# EAGLE design ArduinoShield_SFE_2x16LCD_RGB (EAGLE 6.2)
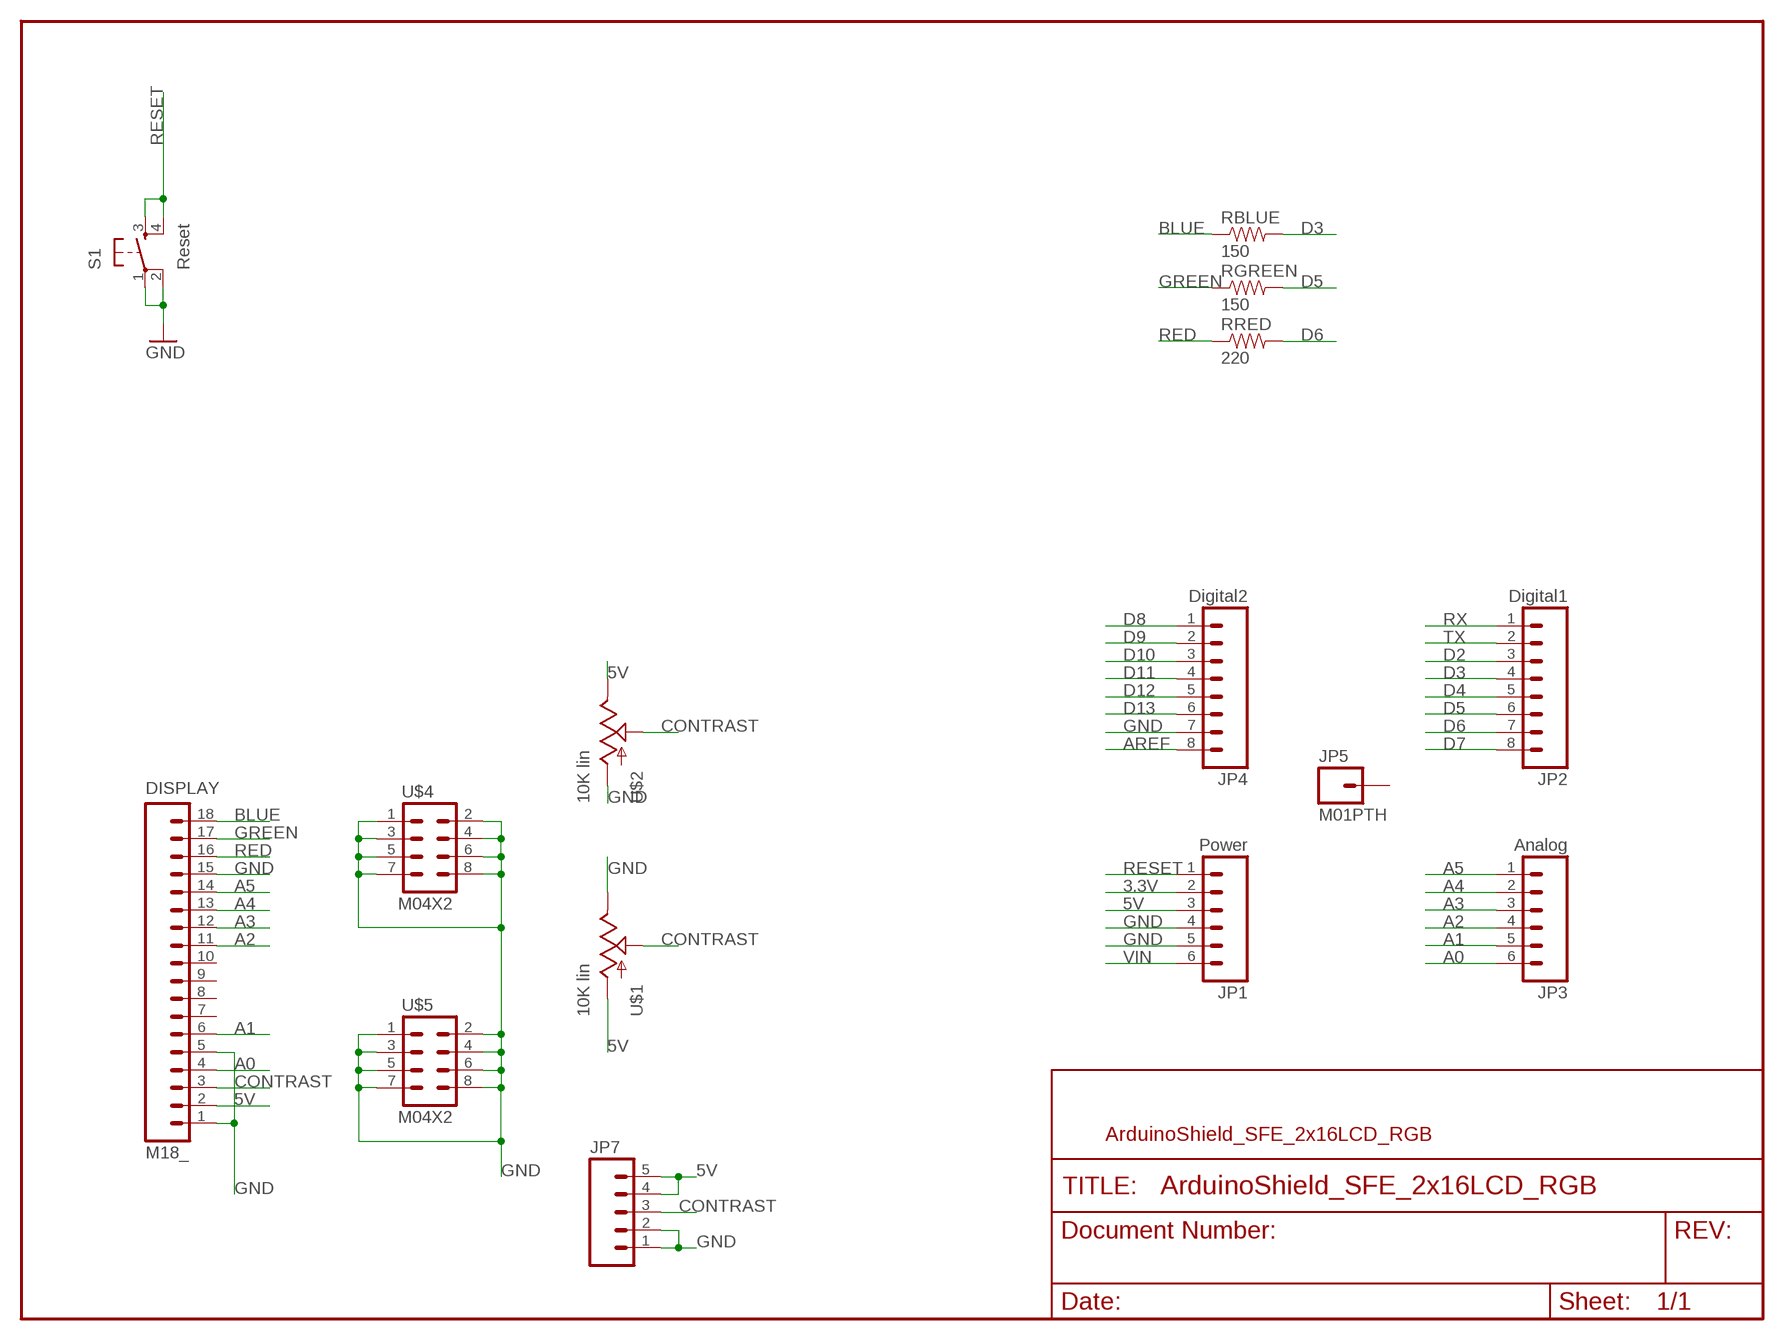
[diagram p0: schematic, sheet 1]

## Parts
DISPLAY  M18_  [1X18]
JP1  Power  M06SIP  [1X06]
JP2  Digital1  M08  [1X08]
JP3  Analog  M06SIP  [1X06]
JP4  Digital2  M08  [1X08]
JP5  M01PTH  [1X01]
JP7  M05PTH_LONGPADS  [1X05_LONGPADS]
RBLUE  150  RESISTORPTH-1/2W  [AXIAL-0.5]
RGREEN  150  RESISTORPTH-1/2W  [AXIAL-0.5]
RRED  220  RESISTORPTH-1/2W  [AXIAL-0.5]
S1  Reset  TAC_SWITCHPTH  [TACTILE-PTH]
U$1  10K lin  POT  [ALPS_POT]
U$2  10K lin  POT-RV16AF-20  [POT_ALPHA_RV16AF-20]
U$4  M04X2  [2X4]
U$5  M04X2  [2X4]

## Nets
3.3V: JP1.2
5V [power]: DISPLAY.2 JP1.3 JP7.4 JP7.5 U$1.P$3(A) U$2.3(E)
A0: DISPLAY.4 JP3.6
A1: DISPLAY.6 JP3.5
A2: DISPLAY.11 JP3.4
A3: DISPLAY.12 JP3.3
A4: DISPLAY.13 JP3.2
A5: DISPLAY.14 JP3.1
AREF: JP4.8
BLUE: DISPLAY.18 RBLUE.P$1
CONTRAST: DISPLAY.3 JP7.3 U$1.P$2(S) U$2.2(S)
D2: JP2.3
D3: JP2.4 RBLUE.P$2
D4: JP2.5
D5: JP2.6 RGREEN.P$2
D6: JP2.7 RRED.P$2
D7: JP2.8
D8: JP4.1
D9: JP4.2
D10: JP4.3
D11: JP4.4
D12: JP4.5
D13: JP4.6
GND [power]: DISPLAY.1 DISPLAY.5 DISPLAY.15 JP1.4 JP1.5 JP4.7 JP7.1 JP7.2 S1.1 S1.2 U$1.P$1(E) U$2.1(A) U$4.1 U$4.2 U$4.3 U$4.4 U$4.5 U$4.6 U$4.7 U$4.8 U$5.1 U$5.2 U$5.3 U$5.4 U$5.5 U$5.6 U$5.7 U$5.8
GREEN: DISPLAY.17 RGREEN.P$1
RED: DISPLAY.16 RRED.P$1
RESET: JP1.1 S1.3 S1.4
RX: JP2.1
TX: JP2.2
VIN [power]: JP1.6
Unconnected: DISPLAY.7 DISPLAY.8 DISPLAY.9 DISPLAY.10 JP5.1

## Notes on the sheet
- ArduinoShield_SFE_2x16LCD_RGB

## Library data of the parts
DISPLAY = SparkFun:M18
JP1 JP3 = SparkFun:M06: Header 6 Standard 6-pin 0.1" header. Use with straight break away headers (SKU : PRT-00116), right angle break away headers (PRT-00553), swiss pins (PRT-00743), machine pins (PRT-00117), and female headers (PRT-00115). Molex polarized connector foot print use with SKU : PRT-08094 with associated crimp pins and housings. NOTES ON THE VARIANTS LOCK and LOCK_LONGPADS... This footprint was designed to help hold the alignment of a through-hole component (i.e. 6-pin header) while soldering it into place. You may notice that each hole has been shifted either up or down by 0.005 of an inch from it's more standard position (which is a perfectly straight line). This slight alteration caused the pins (the squares in the middle) to touch the edges of the holes. Because they are alternating, it causes a "brace" to hold the component in place. 0.005 has proven to be the perfect amount of "off-center" position when using our standard breakaway headers. Although looks a little odd when you look at the bare footprint, once you have a header in there, the alteration is very hard to notice. Also, if you push a header all the way into place, it is covered up entirely on the bottom side. This idea of altering the position of holes to aid alignment will be further integrated into the Sparkfun Library for other footprints. It can help hold any component with 3 or more connection pins.
JP2 JP4 = SparkFun:M08: Header 8 Standard 8-pin 0.1" header. Use with straight break away headers (SKU : PRT-00116), right angle break away headers (PRT-00553), swiss pins (PRT-00743), machine pins (PRT-00117), and female headers (PRT-00115).
JP5 = SparkFun:M01: Header 1 Standard 1-pin 0.1" header. Use with straight break away headers (SKU : PRT-00116), right angle break away headers (PRT-00553), swiss pins (PRT-00743), machine pins (PRT-00117), and female headers (PRT-00115).
JP7 = SparkFun:M05: Header 5 Standard 5-pin 0.1" header. Use with straight break away headers (SKU : PRT-00116), right angle break away headers (PRT-00553), swiss pins (PRT-00743), machine pins (PRT-00117), and female headers (PRT-00115). Molex polarized connector foot print use with SKU : PRT-08230 with associated crimp pins and housings.
RBLUE RGREEN RRED = SparkFun:RESISTOR: Resistor Basic schematic elements and footprints for 0603, 1206, and PTH resistors.
S1 = SparkFun:TAC_SWITCH: Momentary Switch Button commonly used for reset or general input. Spark Fun Electronics SKU : COM-00097
U$1 U$2 = SparkFun:POT
U$4 U$5 = SparkFun:M04X2

## Net classes
1 power: width 0.254 mm

## Board
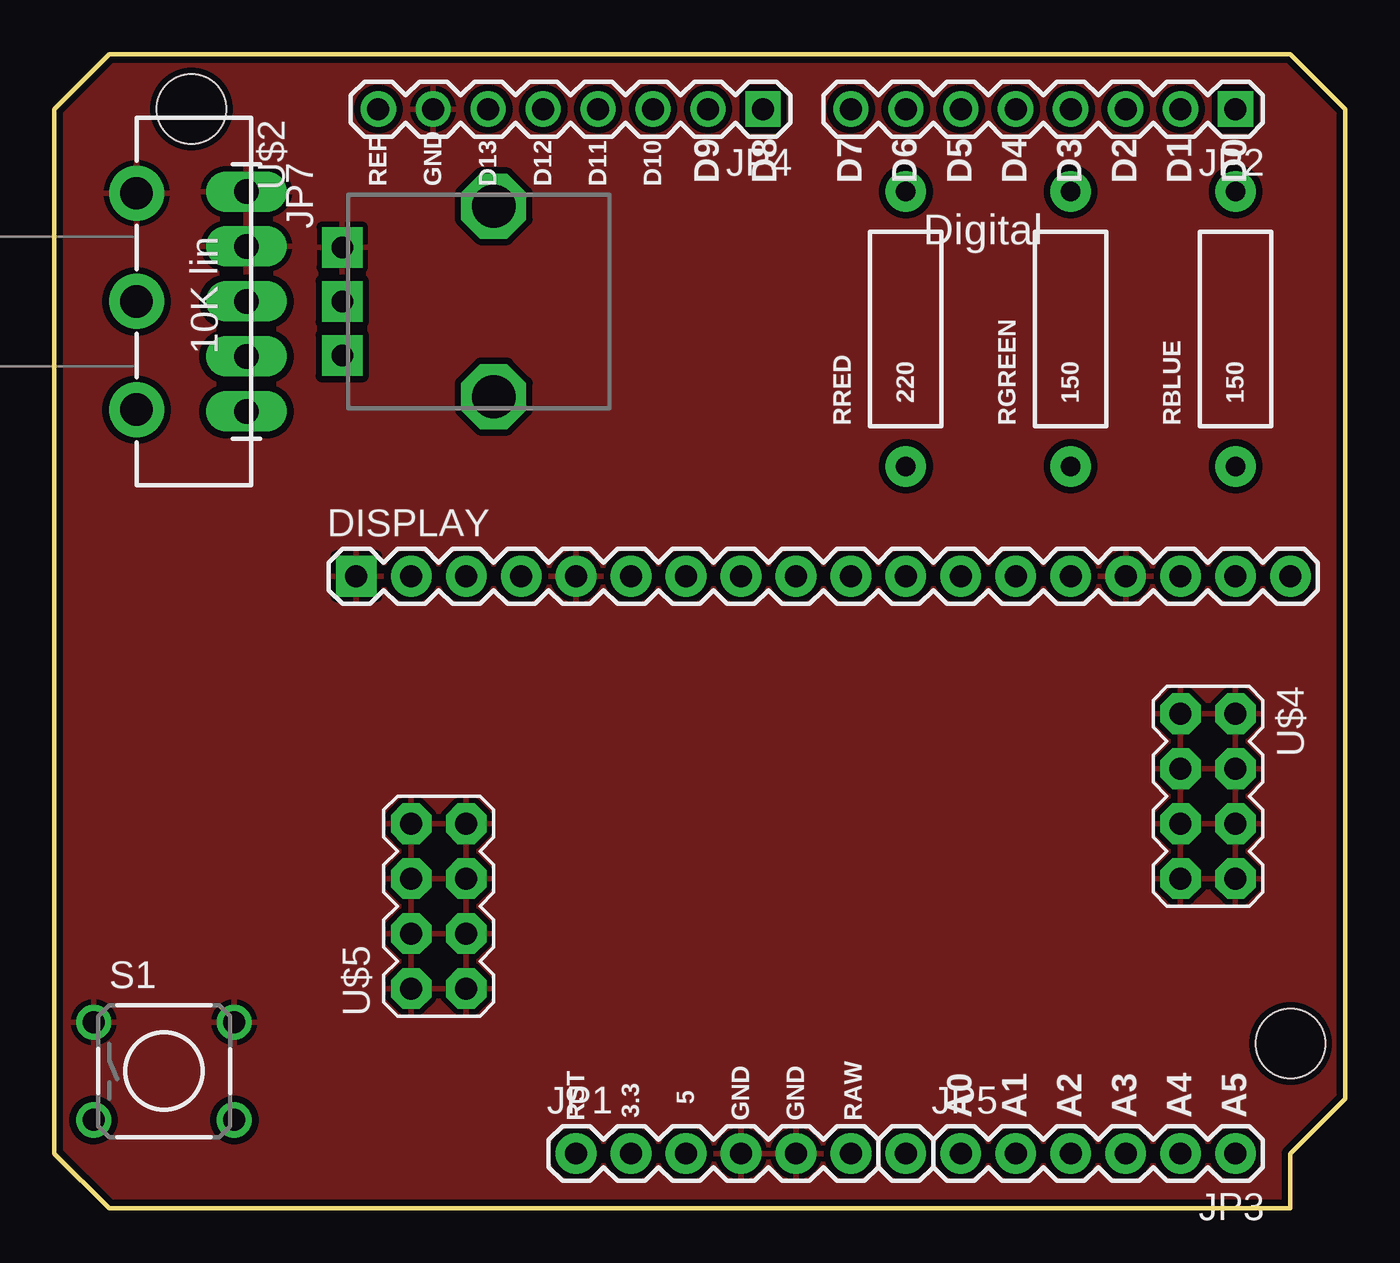
[diagram p1: board, top side]
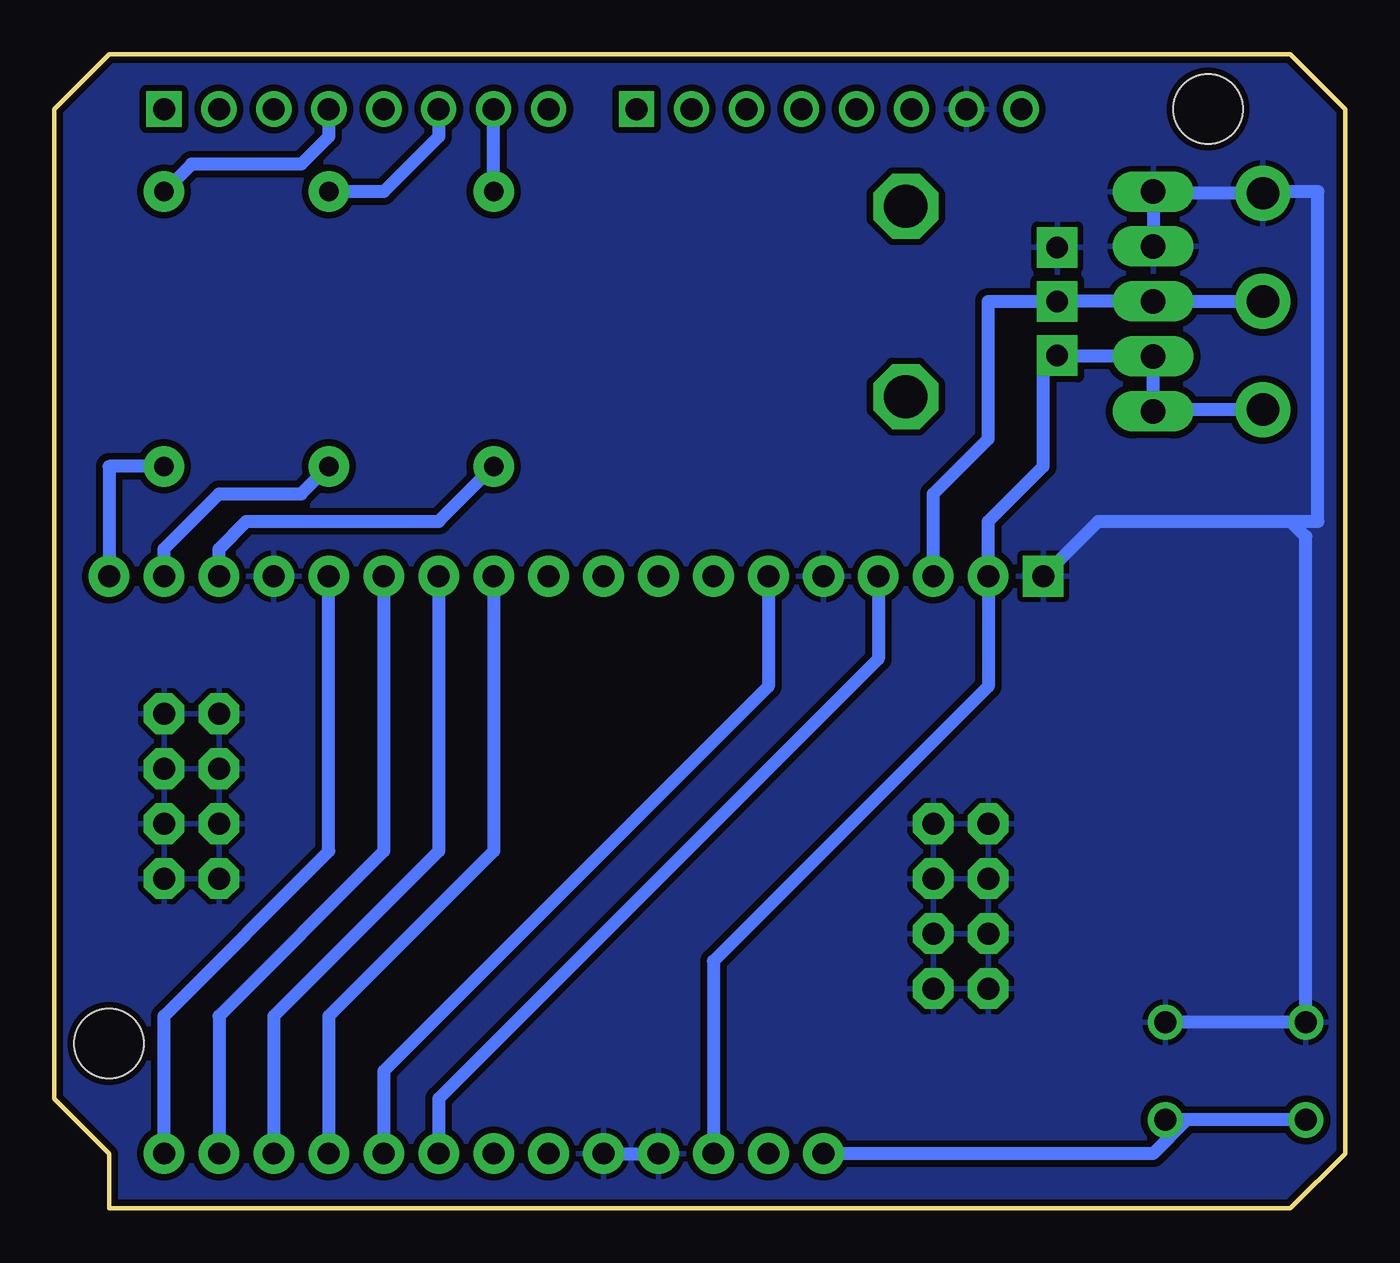
[diagram p2: board, bottom side, seen from below]

Size 59.69 x 53.34 mm. Coordinates in mm from the lower left corner, seen from the top.
Outline: 0,50.8 0,2.54 2.54,0 57.15,0 57.15,2.54 59.69,5.08 59.69,50.8 57.15,53.34 2.54,53.34 0,50.8
Copper layers (1*16): Top 0.035mm / dielectric 1.5mm / Bottom 0.035mm
Design rules: minimum track width 8mil, minimum drill 20mil, track to track 8mil, track to pad 8mil, pad to pad 8mil, via to via 8mil, smd to smd 8mil, copper to edge 10mil, drill to drill 8mil, minimum pad ring 12mil, minimum via ring 10mil, stop-mask expansion 4mil, vias tented up to drill 20mil, thermal gap 10mil
Holes 3.2 mm at 57.15,7.62 6.35,50.8

### Footprints (pad centres in the part's own frame; a part is rotated, then mirrored left to right if it is on the bottom)
1X18 = drill 1.016 pad 1.88 square: 1 0,0 | drill 1.016 pad 1.88: 2 2.54,0; 3 5.08,0; 4 7.62,0; 5 10.16,0; 6 12.7,0; 7 15.24,0; 8 17.78,0; 9 20.32,0; 10 22.86,0; 11 25.4,0; 12 27.94,0; 13 30.48,0; 14 33.02,0; 15 35.56,0; 16 38.1,0; 17 40.64,0; 18 43.18,0
1X06 = drill 1.016 pad 1.88: 1 0,0; 2 2.54,0; 3 5.08,0; 4 7.62,0; 5 10.16,0; 6 12.7,0
1X08 = drill 1.016 square: 1 0,0 | drill 1.016: 2 2.54,0; 3 5.08,0; 4 7.62,0; 5 10.16,0; 6 12.7,0; 7 15.24,0; 8 17.78,0
1X01 = drill 1.016 pad 1.88: 1 0,0
1X05_LONGPADS = drill 1.118 pad 1.88 long: 1 0,0; 2 2.54,0; 3 5.08,0; 4 7.62,0; 5 10.16,0
AXIAL-0.5 = drill 0.9 pad 1.88: P$1 -6.35,0; P$2 6.35,0
TACTILE-PTH = drill 1.016: 1 -3.251,2.261; 2 3.251,2.261; 3 -3.251,-2.261; 4 3.251,-2.261
ALPS_POT = drill 1 pad 1.88 square: P$1 7,-2.5; P$2 7,0; P$3 7,2.5 | drill 2 octagon: P$4 0,-4.4; P$5 0,4.4
POT_ALPHA_RV16AF-20 = drill 1.5 pad 2.54: 1 -5,0; 2 0,0; 3 5,0
2X4 = drill 1.016 pad 1.88 octagon: 1 -3.81,-1.27; 2 -3.81,1.27; 3 -1.27,-1.27; 4 -1.27,1.27; 5 1.27,-1.27; 6 1.27,1.27; 7 3.81,-1.27; 8 3.81,1.27

### Placement (x,y rotation side)
DISPLAY  13.97,29.21 0 top
JP1  24.13,2.54 0 top
JP2  54.61,50.8 180 top
JP3  54.61,2.54 180 top
JP4  32.77,50.8 180 top
JP5  39.37,2.54 0 top
JP7  8.89,46.99 270 top
RBLUE  54.61,40.64 90 top
RGREEN  46.99,40.64 90 top
RRED  39.37,40.64 90 top
S1  5.08,6.35 0 top
U$1  20.32,41.91 180 top
U$2  3.81,41.91 270 top
U$4  53.34,19.05 270 top
U$5  17.78,13.97 90 top

### Tracks (layer width: path | path; a pad name or v marks a point on that pad's centre or on a via)
5V
  Bottom 0.61: U$2.3 8.81,36.91 JP7.5 JP7.4 8.93,39.41 U$1.P$3 13.97,38.76 13.97,34.29 16.51,31.75 DISPLAY.2 16.51,24.13 29.21,11.43 JP1.3
A0
  Bottom 0.61: DISPLAY.4 21.59,25.4 41.91,5.08 JP3.6
A1
  Bottom 0.61: DISPLAY.6 26.67,24.13 44.45,6.35 JP3.5
A2
  Bottom 0.61: DISPLAY.11 39.37,16.51 46.99,8.89 JP3.4
A3
  Bottom 0.61: DISPLAY.12 41.91,16.51 49.53,8.89 JP3.3
A4
  Bottom 0.61: DISPLAY.13 44.45,16.51 52.07,8.89 JP3.2
A5
  Bottom 0.61: JP3.1 54.61,8.89 46.99,16.51 DISPLAY.14
BLUE
  Bottom 0.61: RBLUE.P$1 57.15,34.29 DISPLAY.18
CONTRAST
  Bottom 0.61: DISPLAY.3 19.05,33.02 16.51,35.56 16.51,41.91 U$1.P$2 JP7.3 U$2.2
D3
  Bottom 0.61: JP2.4 46.99,49.53 48.26,48.26 53.34,48.26 RBLUE.P$2
D5
  Bottom 0.61: JP2.6 41.91,49.53 44.45,46.99 RGREEN.P$2
D6
  Bottom 0.61: RRED.P$2 JP2.7
GND
  Bottom 0.61: JP7.2 JP7.1 8.81,46.91 U$2.1 3.73,46.99 1.27,46.99 1.27,31.75 2.54,31.75 | JP1.5 JP1.4 | DISPLAY.1 11.43,31.75 2.54,31.75 | 2.54,31.75 1.83,31.04 S1.1 S1.2
  pour Bottom (isolate 0.305): 66.04,55.88 64.77,0 0,0 0,53.34
  pour Top (isolate 0.305): 66.04,54.61 66.04,0 0,0 0,53.34
GREEN
  Bottom 0.61: DISPLAY.17 54.61,30.48 52.07,33.02 48.26,33.02 RGREEN.P$1
RED
  Bottom 0.61: DISPLAY.16 52.07,30.48 50.8,31.75 41.91,31.75 RRED.P$1
RESET
  Bottom 0.61: S1.3 S1.4 7.34,4.09 8.89,2.54 JP1.1

### Text on the board
tPlace: REF | GND | D13 | D12 | D11 | D10 | D9 | D8 | D7 | D6 | D5 | D4 | D3 | D2 | D1 | D0 | 5 | RST | 3.3 | GND | GND | RAW | A0 | A1 | A2 | A3 | A4 | A5
tNames: Digital